# Altium schematic sheet Carduino.SchDoc: Carduino
size A4; Author: Gergely Takacs; DrawnBy: Gergely Takács; Organization: www.gergelytakacs.com; Revision: 1; SheetNumber: 1; SheetTotal: 1; ProjectName: Carduino
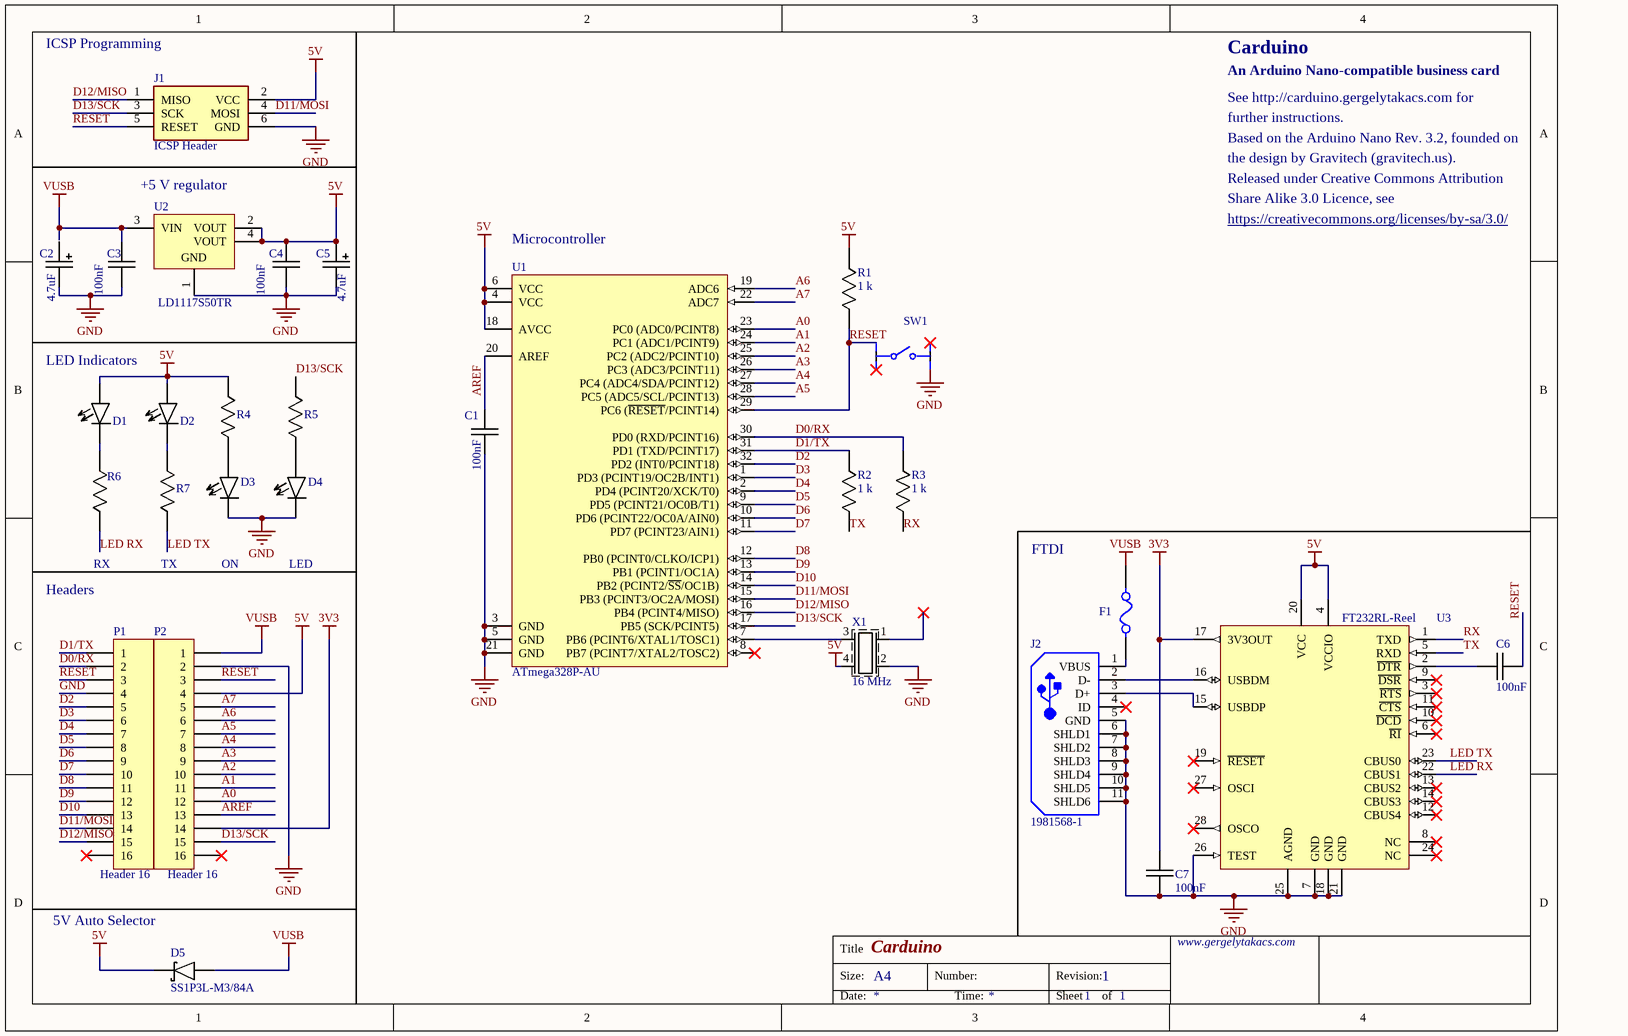
[diagram p0: Carduino.SchDoc]

## Parts
C1  100nF  [CAPC2013X09N]
C2  4.7uF  [CAP body B]
C3  100nF  [CAPC2013X09N]
C4  100nF  [CAPC2013X09N]
C5  4.7uF  [CAP body B]
C6  100nF  [CAPC2013X09N]
C7  100nF  [CAPC2013X09N]
D1  OSXX0805C1E  [DIOC2012X09N]  (value not drawn)
D2  OSXX0805C1E  [DIOC2012X09N]  (value not drawn)
D3  OSXX0805C1E  [DIOC2012X09N]  (value not drawn)
D4  OSXX0805C1E  [DIOC2012X09N]  (value not drawn)
D5  SS1P3L-M3/84A  [DIOM3420X11N]
F1  ECE SR050-06  [RESC2113X12N]  (value not drawn)
J1  Part Number: ICSP Header  [3M_961206-6404-AR_0]  (hidden comment: Conn_3M_961206-6404-AR_eec)
J2  1981568-1  [TECO-1981568-5_V]
P1  Header 16  [HDR1X16]
P2  Header 16  [HDR1X16]
R1  1 k  [RESC2112X05N]
R2  1 k  [RESC2112X05N]
R3  1 k  [RESC2112X05N]
R4  270 Ohm, 0805  [RESC2112X05N]  (value not drawn)
R5  270 Ohm, 0805  [RESC2112X05N]  (value not drawn)
R6  270 Ohm, 0805  [RESC2112X05N]  (value not drawn)
R7  270 Ohm, 0805  [RESC2112X05N]  (value not drawn)
SW1  Switch_TE_1825910-7_eec  [TE_1825910-7_0]  (value not drawn)
U1  ATmega328P-AU  [32A_N]
U2  LD1117S50TR  [SOT-223_N]
U3  FT232RL-Reel  [SSOP-28_N]
X1  16 MHz  [DFN598P720X140-4N]

## Nets
3V3: C7.2 P2.14 U3.17(3V3OUT)
5V: C4.1 C5.1 D1.2 D2.2 D5.1 J1.2(VCC) P2.4 R1.1 R4.1 U1.4(VCC) U1.6(VCC) U1.18(AVCC) U2.2(VOUT) U2.4(VOUT) U3.4(VCCIO) U3.20(VCC) X1.4
GND: C1.2 C2.2 C3.1 C4.2 C5.2 C7.1 D3.1 D4.1 J1.6(GND) J2.5(GND) J2.6(SHLD1) J2.7(SHLD2) J2.8(SHLD3) J2.9(SHLD4) J2.10(SHLD5) J2.11(SHLD6) P1.4 P2.2 SW1.4 U1.3(GND) U1.5(GND) U1.21(GND) U2.1(GND) U3.7(GND) U3.18(GND) U3.21(GND) U3.25(AGND) U3.26(TEST) X1.2
VUSB: C3.2 D5.2 F1.2 P2.1 U2.3(VIN)
A0: P2.12 U1.23(PC0_(ADC0/PCINT8))
A1: P2.11 U1.24(PC1_(ADC1/PCINT9))
A2: P2.10 U1.25(PC2_(ADC2/PCINT10))
A3: P2.9 U1.26(PC3_(ADC3/PCINT11))
A4: P2.8 U1.27(PC4_(ADC4/SDA/PCINT12))
A5: P2.7 U1.28(PC5_(ADC5/SCL/PCINT13))
A6: P2.6 U1.19(ADC6)
A7: P2.5 U1.22(ADC7)
AREF: C1.1 P2.13 U1.20(AREF)
D0/RX: P1.2 R3.2 U1.30(PD0_(RXD/PCINT16))
D1/TX: P1.1 R2.1 U1.31(PD1_(TXD/PCINT17))
D2: P1.5 U1.32(PD2_(INT0/PCINT18))
D3: P1.6 U1.1(PD3_(PCINT19/OC2B/INT1))
D4: P1.7 U1.2(PD4_(PCINT20/XCK/T0))
D5: P1.8 U1.9(PD5_(PCINT21/OC0B/T1))
D6: P1.9 U1.10(PD6_(PCINT22/OC0A/AIN0))
D7: P1.10 U1.11(PD7_(PCINT23/AIN1))
D8: P1.11 U1.12(PB0_(PCINT0/CLKO/ICP1))
D9: P1.12 U1.13(PB1_(PCINT1/OC1A))
D10: P1.13 U1.14(PB2_(PCINT2/~{SS}/OC1B))
D11/MOSI: J1.4(MOSI) P1.14 U1.15(PB3_(PCINT3/OC2A/MOSI))
D12/MISO: J1.1(MISO) P1.15 U1.16(PB4_(PCINT4/MISO))
D13/SCK: J1.3(SCK) P2.15 R5.1 U1.17(PB5_(SCK/PCINT5))
LED RX: R6.2 U3.22(CBUS1)
LED TX: R7.2 U3.23(CBUS0)
RESET: C6.2 J1.5(RESET) P1.3 P2.3 R1.2 SW1.1 U1.29(PC6_(~{RESET}/PCINT14))
RX: R3.1 U3.1(TXD)
TX: R2.2 U3.5(RXD)
NetC6_1: C6.1 U3.2(~{DTR})
NetD1_1: D1.1 R6.1
NetD2_1: D2.1 R7.1
NetD3_2: D3.2 R4.2
NetD4_2: D4.2 R5.2
NetF1_1: F1.1 J2.1(VBUS)
NetJ2_2: J2.2(D-) U3.16(USBDM)
NetJ2_3: J2.3(D+) U3.15(USBDP)
NetU1_7: U1.7(PB6_(PCINT6/XTAL1/TOSC1)) X1.3

Not connected (* = marked no-connect by the designer): C2 1; J2 4(ID)*; P1 16*; P2 16*; SW1 2* 3*; U1 8(PB7_(PCINT7/XTAL2/TOSC2))*; U3 3(~{RTS})* 6(~{RI})* 8(NC)* 9(~{DSR})* 10(~{DCD})* 11(~{CTS})* 12(CBUS4)* 13(CBUS2)* 14(CBUS3)* 19(~{RESET})* 24(NC)* 27(OSCI)* 28(OSCO)*; X1 1*

## Notes on the sheet
- (near J1) ICSP Programming
- An Arduino Nano-compatible business card
- Carduino
- See http://carduino.gergelytakacs.com for
- further instructions.
- Based on the Arduino Nano Rev. 3.2, founded on
- the design by Gravitech (gravitech.us).
- +5 V regulator
- (near U1) Microcontroller
- Released under Creative Commons Attribution
- Share Alike 3.0 Licence, see
- https://creativecommons.org/licenses/by-sa/3.0/
- LED Indicators
- (near R6) RX
- (near R7) TX
- ON
- LED
- FTDI
- Headers
- 5V Auto Selector
- Title
- Size:
- A4
- Number:
- Revision:
- Date:
- Time:
- Sheet
- of

## Library data of the parts
C1 C3 C4 C6 C7 = 100 uF,  ceramic, 0805, Kemet: Ceramic condenser MLCC; 100nF; 25V; X7R; ±10%; SMD; 0805
C2 C5 = 4.7uF, Tantallum: 4,7uF; 25VDC; SMD; Puzd: B; ±10%; -55÷125°C
D1-D4 = OptoSupply RED: OptoSupply Single Chip LED 0805; CREATOR: Gergely Takacs; CREATOR WWW: http://www.gergelytakacs.com; DATASHEET URL: https://www.tme.eu/sk/Document/6f99baddc8b38eb1a865ea6b78250b2b/OSXX0805C1E-DTE.pdf
D5 = SS1P3L: VISHAY SS1P3L-M3/84A  Dióda: usmerňovacia Schottky; SMD; 30V; 1A; DO220AA, SMP
F1 = ECE SR050-06: FUSE PTC RESETTABLE .50A
J1 = Conn_3M_961206-6404-AR_eec: CONN HEADER VERT DUAL 6POS GOLD; Manufacturer: 3M; helpURL: https://upverter.com/upn/revision/048db89806b755ca/; ComponentLink2Description: Datasheet; Temperature: -25°C to +105°C; Package: HDR6; Supplier 2: Mouser; Price: 0.298634614737; Supplier 1: Digi-Key; ComponentLink1URL: https://upverter.com/upn/revision/048db89806b755ca/; Supplier Part Number 2: 517-9612066404AR; Supplier Part Number 1: 3M9466-06-ND; ComponentLink1Description: Upverter; ComponentLink2URL: https://media.digikey.com/pdf/Data%20Sheets/3M%20PDFs/961_Series.pdf; RoHS: TRUE; Mouser Part Number: 517-9612066404AR; Temperature Range High: +105°C; Digikey Description: CONN HEADER VERT DUAL 6POS GOLD; Digikey Part Number: 3M9466-06-ND; Temperature Range Low: -25°C; Lead Free: yes
J2 = 1981568-1: Micro USB Receptacle Standard Type B Assy, 5-Pin SMD, RoHS, Tape and Reel; Manufacturer: TE Connectivity; Current Rating (Max): 1/ContactA; Product Height (mm): 3mm; Gender: RCP; Body Orientation: RightAngle; Number of Ports: 1Port; Voltage Rating Max: 30VAC; Number of Contacts: 5POS; Product Depth (mm): 5.6mm; Pitch (mm): 0.65mm; Product Length (mm): 8mm; Housing Material: Thermoplastic; Type: MicroUSB; Packaging: TapeandReel; Manufacturer URL: http://www.te.com/; Datasheet Version: Rev. E2, 08/2015; Contact Plating: GoldOverNickel; Termination Method: Solder; Operating Temperature Min Deg. C: -55C; Datasheet URL: http://www.mouser.com/ds/2/418/NG_CD_1981568_E2-621296.pdf; Operating Temp Range: -55Cto85C; Operating Temperature Max Deg. C: 85C; Number of Terminals: 5; Mounting Style: SurfaceMount; Contact Material: CopperAlloy; PartNumber: 1981568-1
P1 P2 = Header 16: Header, 16-Pin; LatestRevisionDate: 17-Jul-2002; LatestRevisionNote: Re-released for DXP Platform.; Publisher: Altium Limited
R1-R3 = 1k, 0805, Royal Ohm: ROYAL OHM HP05W3F1001T5E  Rezistor: thick film; vysokovýkonný; SMD; 0805; 1kΩ; 0,3W; ±1%
R4-R7 = 270 Ohm, 0805, Resistor: VISHAY CRCW...BC Thick Film Commodity Resistor
SW1 = Switch_TE_1825910-7_eec: SWITCH Tactile Switch SPST-NO Top Actuated Through Hole; Manufacturer: TE; Operating Force: 260gf; Contact Rating @ Voltage: 0.05A @ 24VDC; Mechanical Life: 100,000 Cycles; Actuator Height off PCB, Vertical: 5.00mm; Switch Travel: 0.25mm; Outline: 6.00mm x 6.00mm; Switch Function: Off-Mom; Actuator Type: Standard; Actuator Material: Polybutylene Terephthalate (PBT); Illumination: Non-Illuminated; Part Number: 1825910-7; helpURL: https://upverter.com/upn/revision/149b3552d7425f0e/; ComponentLink2Description: Datasheet; Temperature: -35°C to +85°C; Package: Through Hole; Supplier 2: Mouser; Supplier 1: Digi-Key; ComponentLink1URL: https://upverter.com/upn/revision/149b3552d7425f0e/; Supplier Part Number 2: 506-FSM4JAH; Supplier Part Number 1: 450-1804-ND; ComponentLink1Description: Upverter; ComponentLink2URL: http://www.te.com/commerce/DocumentDelivery/DDEController?Action=srchrtrv&DocNm=1825910&DocType=Customer+Drawing&DocLang=English; RoHS: TRUE; Mouser Part Number: 506-FSM4JAH; Termination Style: PC Pin; Actuator Orientation: Top Actuated; Temperature Range High: +85°C; Digikey Description: SWITCH Tactile Switch SPST-NO Top Actuated Through Hole; Digikey Part Number: 450-1804-ND; Lead Free: yes; Circuit: SPST-NO; Temperature Range Low: -35°C; Mounting Type: Through Hole
U1 = ATmega328P-AU: 8-bit AVR Microcontroller, 32KB Flash, 1KB EEPROM, 2KB SRAM, 32-pin TQFP, Industrial Grade (-40°C to 85°C); DatasheetVersion: revD, May-2011; PackageVersion: revC, Oct-2010; PackageReference: 32A; PackageDescription: 32-Lead, 7x7x1.0 mm Body, 0.8mm Lead Pitch, Thin Profile Plastic Quad Flat Package (TQFP); Code_JEDEC: MS-026-ABA; ComponentLink1Description: Manufacturer URL; ComponentLink1URL: http://www.atmel.com/; ComponentLink2Description: ATmega48A/48PA/88A/88PA/168A/168PA/328/328P Datasheet; ComponentLink2URL: http://www.atmel.com/dyn/resources/prod_documents/doc8271.pdf; ComponentLink3Description: ATmega48A/48PA/88A/88PA/168A/168PA/328/328P Summary; ComponentLink3URL: http://www.atmel.com/dyn/resources/prod_documents/8271S.pdf
U2 = LD1117S50TR: Fixed Low Drop Positive Voltage Regulator, 5V, 4-Pin SOT-223, Tape and Reel; DatasheetVersion: Nov-2011; PackageVersion: 2010; PackageReference: SOT-223; PackageDescription: 4-Pin SOT-223 Package, 6.5 x 3.5 mm Body, 2.3 mm Pitch, 7 mm Lead Span; PartNumber: LD1117S50TR; ComponentLink1Description: Manufacturer URL; ComponentLink1URL: http://www.st.com; ComponentLink2Description: Datasheet; ComponentLink2URL: http://www.st.com/internet/com/TECHNICAL_RESOURCES/TECHNICAL_LITERATURE/DATASHEET/CD00000544.pdf
U3 = FT232RL-Reel: USB UART Asynchronous Serial Data Transfer Chip, 28-pin SSOP, Tape and Reel; Manufacturer: FTDI; DatasheetVersion: ver 2.10, Mar-2012; PackageVersion: Mar-12; PackageReference: SSOP-28; PackageDescription: 28-Pin Small Outline Package 0.65 mm Pitch; PartNumber: FT232RL-Reel; ComponentLink1Description: Manufacturer URL; ComponentLink1URL: http://www.ftdichip.com/; ComponentLink2Description: Datasheet; ComponentLink2URL: http://www.ftdichip.com/Support/Documents/DataSheets/ICs/DS_FT232R.pdf
X1 = 16 MHz, IQD FREQUENCY PRODUCTS: QD FREQUENCY PRODUCTS LF SPXO018034